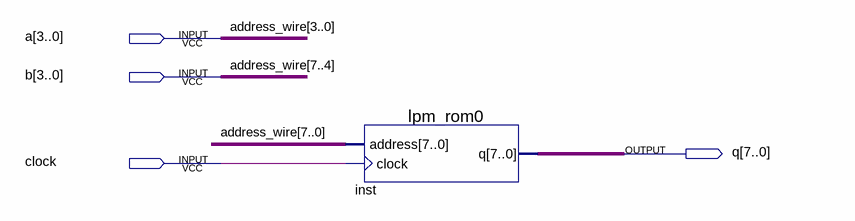
[diagram p0: schematic sheet]
// Quartus schematic MultiplyingUnit.bdf as structural Verilog: 1 symbols, 4 pins
module MultiplyingUnit (
  input  [3:0] a,
  input  [3:0] b,
  input  clock,
  output [7:0] q
);

  lpm_rom0 inst (.address({b, a}), .clock(clock), .q(q));

  // Other names for the same wires on the sheet: address_wire[7:0] = {b, a}
endmodule
